# EAGLE schematic PCB-Switches (EAGLE 9.5.2)
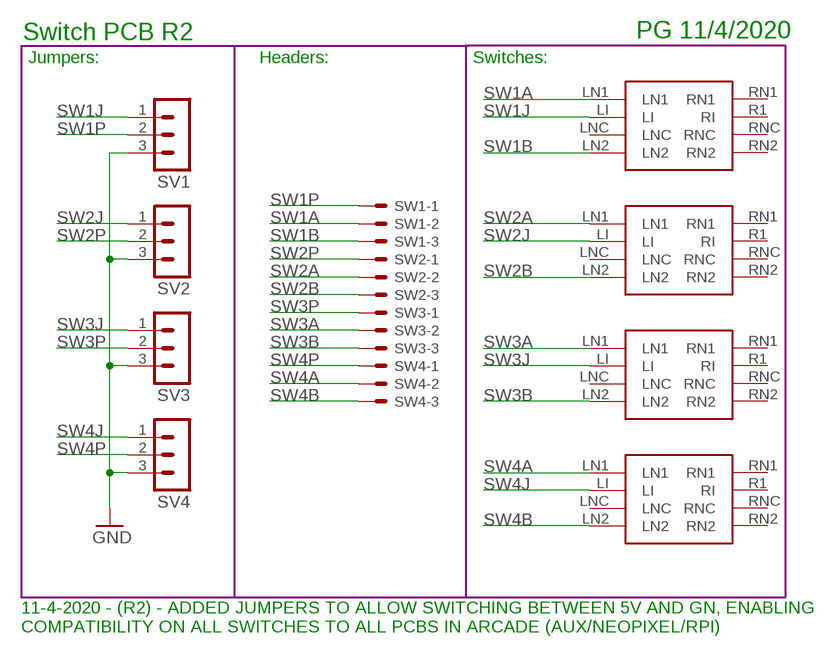
[diagram p0: schematic, sheet 1]

## Parts
SV1  MA03-1  [MA03-1]
SV2  MA03-1  [MA03-1]
SV3  MA03-1  [MA03-1]
SV4  MA03-1  [MA03-1]
SW1  KK-156-3  [KK-156-3]
SW2  KK-156-3  [KK-156-3]
SW3  KK-156-3  [KK-156-3]
SW4  KK-156-3  [KK-156-3]
U$1  ARCADESWITCH  [ARCADESWITCH]
U$2  ARCADESWITCH  [ARCADESWITCH]
U$3  ARCADESWITCH  [ARCADESWITCH]
U$4  ARCADESWITCH  [ARCADESWITCH]

## Nets
GND: SV1.3 SV2.3 SV3.3 SV4.3
SW1A: SW1.2 U$1.LN1
SW1B: SW1.3 U$1.LN2
SW1J: SV1.1 U$1.LI
SW1P: SV1.2 SW1.1
SW2A: SW2.2 U$2.LN1
SW2B: SW2.3 U$2.LN2
SW2J: SV2.1 U$2.LI
SW2P: SV2.2 SW2.1
SW3A: SW3.2 U$3.LN1
SW3B: SW3.3 U$3.LN2
SW3J: SV3.1 U$3.LI
SW3P: SV3.2 SW3.1
SW4A: SW4.2 U$4.LN1
SW4B: SW4.3 U$4.LN2
SW4J: SV4.1 U$4.LI
SW4P: SV4.2 SW4.1
Unconnected: U$1.LNC U$1.R1(RI) U$1.RN1 U$1.RN2 U$1.RNC U$2.LNC U$2.R1(RI) U$2.RN1 U$2.RN2 U$2.RNC U$3.LNC U$3.R1(RI) U$3.RN1 U$3.RN2 U$3.RNC U$4.LNC U$4.R1(RI) U$4.RN1 U$4.RN2 U$4.RNC

## Notes on the sheet
- Switch PCB R2 | PG 11/4/2020
- Jumpers: | Headers: | Switches:
- 11-4-2020 - (R2) - ADDED JUMPERS TO ALLOW SWITCHING BETWEEN 5V AND GN, ENABLING 
  COMPATIBILITY ON ALL SWITCHES TO ALL PCBS IN ARCADE (AUX/NEOPIXEL/RPI)

## Library data of the parts
SV1-SV4 = con-lstb:MA03-1: PIN HEADER; OC_FARNELL: unknown; OC_NEWARK: unknown
SW1-SW4 = con-molex:KK-156-3: KK 156 HEADER Source: http://www.molex.com/pdm_docs/sd/026604100_sd.pdf; MF: MOLEX; OC_FARNELL: unknown; OC_NEWARK: unknown
U$1-U$4 = Arcade Switch:ARCADESWITCH